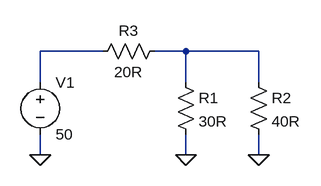
[diagram p0: schematic Thevenin 1.asc]
Thevenin 1.asc, the LTspice schematic file:
Version 4
SHEET 1 880 680
WIRE 80 64 -16 64
WIRE 208 64 160 64
WIRE 320 64 208 64
WIRE -16 112 -16 64
WIRE 208 112 208 64
WIRE 320 112 320 64
WIRE -16 224 -16 192
WIRE 208 224 208 192
WIRE 320 224 320 192
FLAG 208 224 0
FLAG 320 224 0
FLAG -16 224 0
SYMBOL res 192 96 R0
SYMATTR InstName R1
SYMATTR Value 30R
SYMBOL res 304 96 R0
SYMATTR InstName R2
SYMATTR Value 40R
SYMBOL res 176 48 R90
WINDOW 0 0 56 VBottom 2
WINDOW 3 32 56 VTop 2
SYMATTR InstName R3
SYMATTR Value 20R
SYMBOL voltage -16 96 R0
WINDOW 123 0 0 Left 0
WINDOW 39 0 0 Left 0
SYMATTR InstName V1
SYMATTR Value 50

The netlist it stands for:
* Thevenin 1.asc
R1 N002 0 30R
R2 N002 0 40R
R3 N002 N001 20R
V1 N001 0 50
.backanno
.end